# EasyEDA Pro project AD8302_嘉立创.eprj

# Schematic Schematic1
Create Date: 2023-10-31; Page Name: P1; Project Name: AD8302_copy; Schematic Name: Schematic1; Update Date: 2023-11-06; Company: 嘉立创EDA; Page Size: A4; Version: V1.0
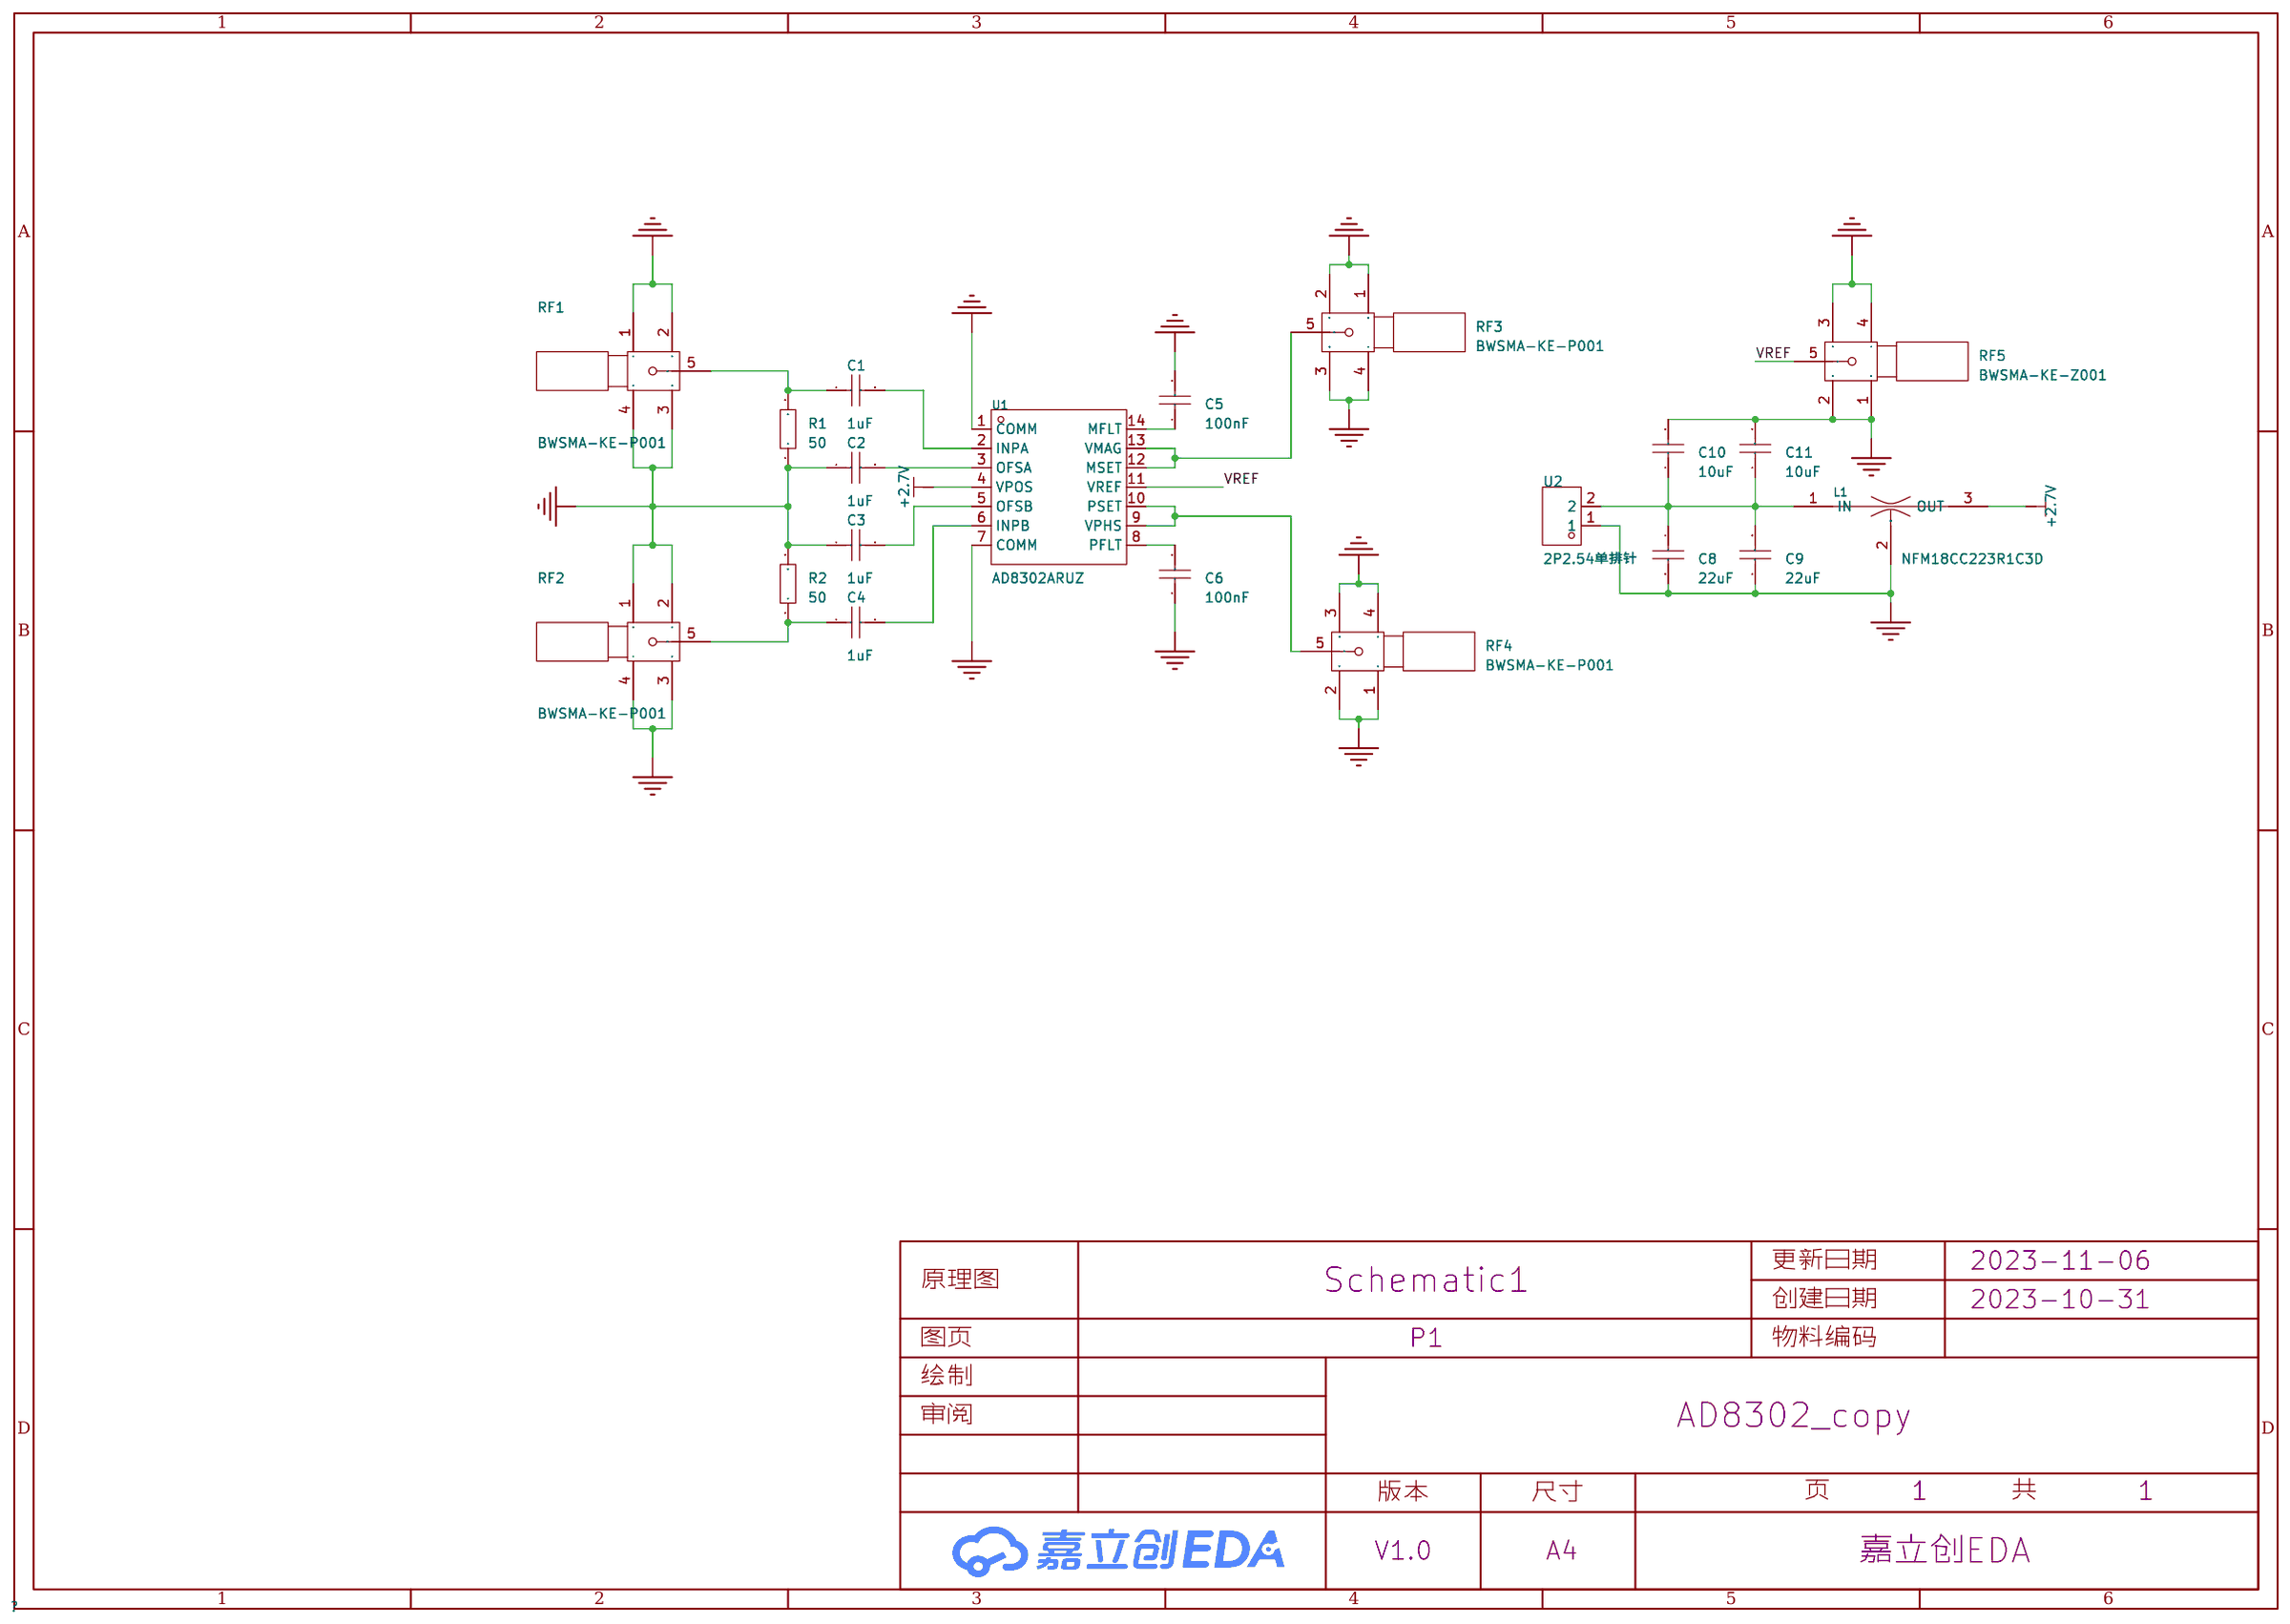
[diagram p0: schematic sheet]

## Parts
C1  1uF  [C0603]
C2  1uF  [C0603]
C3  1uF  [C0603]
C4  1uF  [C0603]
C5  100nF  [C0603]
C6  100nF  [C0603]
C8  22uF  [C0805]
C9  22uF  [C0805]
C10  10uF  [C0603]
C11  10uF  [C0603]
L1  NFM18CC223R1C3D  [FILTER-SMD_3P-L1.6-W0.8-L_NFM18CC223R1C3D]
R1  50  [R0603]
R2  50  [R0603]
RF1  BWSMA-KE-P001  [SMA-SMD_BWSMA-KE-P001]
RF2  BWSMA-KE-P001  [SMA-SMD_BWSMA-KE-P001]
RF3  BWSMA-KE-P001  [SMA-SMD_BWSMA-KE-P001]
RF4  BWSMA-KE-P001  [SMA-SMD_BWSMA-KE-P001]
RF5  BWSMA-KE-Z001  [SMA-TH_BWSMA-KE-Z001]
U1  AD8302ARUZ  [TSSOP-14_L5.0-W4.4-P0.65-LS6.4-BL]
U2  2P2.54单排针  [HDR-TH_2P-P2.54-V-M]

## Library data of the parts
C1-C6 C8-C11 = CL10A105KB8NNNC: 容值:1uF;精度:±10%;额定电压:50V;材质(温度系数):X5R;; LCSC Part Name: 1uF ±10% 50V; Supplier Part: C45783; Manufacturer: SAMSUNG(三星); Supplier Footprint: 0603; JLCPCB Part Class: 基础库; Datasheet: https://atta.szlcsc.com/upload/public/pdf/source/20160103/1457707679084.pdf; Supplier: LCSC; Tolerance: ±10%; Voltage Rated: 50V; Temperature Coefficient: X5R
L1 = NFM18CC223R1C3D: 电容量:22nF;精度:±20%;直流电阻:50mΩ;; LCSC Part Name: 22nF(223) ±20% 16V; Supplier Part: C98102; Manufacturer: muRata(村田); Supplier Footprint: SMD-3P,0.8x1.6mm; JLCPCB Part Class: 扩展库; Datasheet: https://atta.szlcsc.com/upload/public/pdf/source/20170310/1489116427722.pdf; Supplier: LCSC; Nominal Capacitance: 22nF; CapacitanceTolerance: ±20%; DC Rated Voltage: 16V; Rated Current: 1A; DC Resistance: 50mΩ; Operating Temperature: -55℃~+125℃
R1 R2 = Res_0603: Supplier Footprint: 0603; Supplier Part: C2759402
RF1-RF4 = BWSMA-KE-P001: 连接器类型:板端;射频系列:SMA;接口类型:内孔;端口数量:1;阻抗:50Ω;频率-最大值:12.4GHz;样式:偏脚;接口直径:5.2mm;接口长度/高度:-;工作温度范围:-;; LCSC Part Name: SMA 内孔 偏脚 SMA偏脚板端座子; Supplier Part: C496550; Manufacturer: BAT WIRELESS(蝙蝠无线); Supplier Footprint: 插件; JLCPCB Part Class: 扩展库; Datasheet: https://atta.szlcsc.com/upload/public/pdf/source/20200416/C496550_06668BF2E3B968EA39F96D17E7156373.pdf; Supplier: LCSC; Connector Type: 板端; RF Series: SMA; Interface Type: 内孔; Number of Ports: 1; Impedance: 50Ω; Frequency-Max: 12.4GHz; Style: 偏脚; Interface Diameter: 5.2mm
RF5 = BWSMA-KE-Z001_C496549: 连接器类型:板端;射频系列:SMA;接口类型:内孔;端口数量:1;阻抗:50Ω;频率-最大值:12.4GHz;样式:正脚;接口直径:-;接口长度/高度:-;工作温度范围:-65℃~+165℃;; LCSC Part Name: SMA 内孔 正脚 SMA直头正脚板端座子; Supplier Part: C496549; Manufacturer: BAT WIRELESS(蝙蝠无线); Supplier Footprint: 插件; JLCPCB Part Class: 扩展库; Datasheet: https://atta.szlcsc.com/upload/public/pdf/source/20200416/C496549_767995352B6C9E98F20D658FDC70347F.pdf; Supplier: LCSC; Connector Type: 板端; RF Series: SMA; Interface Type: 内孔; Number of Ports: 1; Impedance: 50Ω; Frequency-Max: 12.4GHz; Style: 正脚; Operating Temperature Range: -65℃~+165℃
U1 = AD8302ARUZ: 应用领域:通用;频率范围:2.7GHz;输入范围:-60dBm~0dBm;精度:±0.5dB;; Supplier Part: C578682; Manufacturer: ADI(亚德诺); Supplier Footprint: TSSOP-14; JLCPCB Part Class: Extended Part; Datasheet: https://atta.szlcsc.com/upload/public/pdf/source/20190807/C408900_5BB3D180A454BA6F4D99553AB0F529A5.pdf; Supplier: LCSC; Applications: 通用; Frequency Range: 2.7GHz; Supply Voltage: 2.7V~5.5V; Supply Current: 23mA; Input Range: -60dBm~0dBm; Accuracy: ±0.5dB
U2 = 2P2.54单排针: Supplier Part: C9900015265; Supplier Footprint: HDR1X2; JLCPCB Part Class: 扩展库; Datasheet: https://atta.szlcsc.comnull; Supplier: LCSC

## Nets
+2.7V: L1.3(OUT) U1.4(VPOS)
GND: C2.1 C3.1 C5.2 C6.2 C8.2 C9.1 C10.2 C11.2 L1.2(GND) R1.1 R2.2 RF1.1 RF1.2 RF1.3 RF1.4 RF2.1 RF2.2 RF2.3 RF2.4 RF3.1 RF3.2 RF3.3 RF3.4 RF4.1 RF4.2 RF4.3 RF4.4 RF5.1 RF5.2 RF5.3 RF5.4 U1.1(COMM) U1.7(COMM) U2.1
VREF: RF5.5 U1.11(VREF)
$1N2986: C2.2 U1.3(OFSA)
$1N2989: C1.2 U1.2(INPA)
$1N3092: C3.2 U1.5(OFSB)
$1N3097: C4.2 U1.6(INPB)
$1N3135: C4.1 R2.1 RF2.5
$1N3140: C1.1 R1.2 RF1.5
$1N3454: C6.1 U1.8(PFLT)
$1N3571: C5.1 U1.14(MFLT)
$1N3581: RF3.5 U1.12(MSET) U1.13(VMAG)
$1N3599: RF4.5 U1.9(VPHS) U1.10(PSET)
$1N3862: C8.1 C9.2 C10.1 C11.1 L1.1(IN) U2.2

# Board PCB1
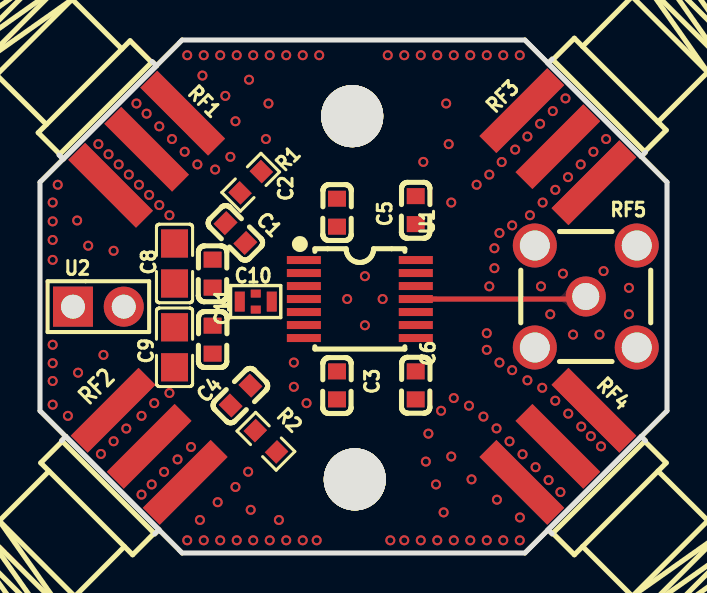
[diagram p1: board, top side]
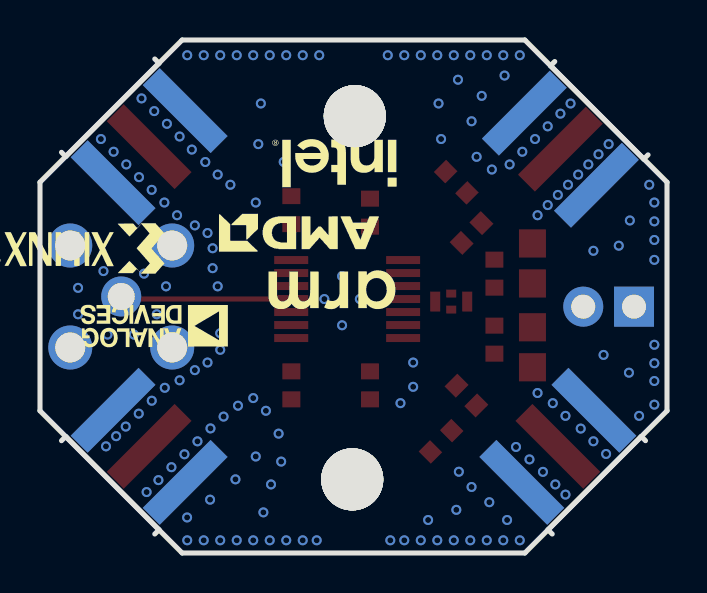
[diagram p2: board, bottom side, seen from below]

Outline 31.37 x 25.65 mm; copper layers: Top Layer, Bottom Layer. Coordinates in mm from the lower left corner of the outline.
Outline path: 0,18.54 0,7.11 7.11,0 24.26,0 31.37,7.11 31.37,18.54 24.26,25.65 7.11,25.65 0,18.54
Stack: Top Layer 0.035mm / Dielectric1 1.51mm FR4 er 4.5 / Bottom Layer 0.035mm

## Design rules (mm)
template: 自定义配置
spacing copperThickness1oz (default): track to track 0.102, other pairs 0.152 to 0.3
spacing copperThickness2oz: track to track 0.203, other pairs 0.152 to 0.3
track width copperThickness1oz (default): min 0.127, default 0.254, max 2.54
track width copperThickness2oz: min 0.203, default 0.254, max 2.54
differential pair differentialPair (default): width min 0.127, default 0.254, max 2.54; gap min 0.152, default 0.152
via viaSize (default): diameter min 0.5, default 0.61, max 10; hole min 0.3, default 0.305, max 6.3

## Placement (name value [footprint] x y rotation side)
C1  1uF  [C0603]  9.78 16 315 top
C2  1uF  [C0603]  14.86 17.02 270 top
C3  1uF  [C0603]  14.86 8.38 90 top
C4  1uF  [C0603]  10.03 7.87 45 top
C5  100nF  [C0603]  18.8 17.14 90 top
C6  100nF  [C0603]  18.8 8.38 270 top
C8  22uF  [C0805]  6.73 14.48 90 top
C9  22uF  [C0805]  6.73 10.29 90 top
C10  10uF  [C0603]  8.64 13.97 90 top
C11  10uF  [C0603]  8.64 10.67 270 top
L1  NFM18CC223R1C3D  [FILTER-SMD_3P-L1.6-W0.8-L_NFM18CC223R1C3D]  10.79 12.57 0 top
NOREF  -  [Pad_e194]  15.62 21.84 0 top
NOREF#2  -  [Pad_e113]  15.62 21.84 0 top
NOREF#3  -  [Pad_e112]  15.75 3.68 0 top
NOREF#4  -  [Pad_e86]  15.62 21.84 0 top
NOREF#5  -  [Pad_e85]  15.75 3.68 0 top
NOREF#6  -  [Pad_e143]  15.75 3.68 0 top
R1  50  [R0603]  10.54 18.54 225 top
R2  50  [R0603]  11.3 5.59 315 top
RF1  BWSMA-KE-P001  [SMA-SMD_BWSMA-KE-P001]  5.33 20.19 135 top
RF2  BWSMA-KE-P001  [SMA-SMD_BWSMA-KE-P001]  5.46 5.33 225 top
RF3  BWSMA-KE-P001  [SMA-SMD_BWSMA-KE-P001]  25.91 20.32 45 top
RF4  BWSMA-KE-P001  [SMA-SMD_BWSMA-KE-P001]  25.91 5.33 315 top
RF5  BWSMA-KE-Z001  [SMA-TH_BWSMA-KE-Z001]  27.31 12.83 0 top
U1  AD8302ARUZ  [TSSOP-14_L5.0-W4.4-P0.65-LS6.4-BL]  16 12.7 270 top
U2  2P2.54单排针  [HDR-TH_2P-P2.54-V-M]  2.92 12.32 0 top

## Footprints (pads in the part's own frame, mm; a bottom-side part is the same pattern mirrored in y, then rotated)
C0603
  rect 0.8x0.9 smd: 1(-0.7,0) 2(0.7,0)
C0805
  rect 1.41x1.35 smd: 1(-1,0) 2(1,0)
FILTER-SMD_3P-L1.6-W0.8-L_NFM18CC223R1C3D
  rect 0.5x1 smd: 1(-0.8,0) 3(0.8,0)
  rect 0.5x0.4 smd: 2(0,0.4) 2(0,-0.4)
HDR-TH_2P-P2.54-V-M
  rect 2x2 hole 1.2: 1(-1.27,0)
  round 2 hole 1.2: 2(1.27,0)
Pad_e85
  round 3.099 hole 3.099: 15(0,0)
Pad_e86
  round 3.099 hole 3.099: 15(0,0)
Pad_e112
  round 3.099 hole 3.099: 15(0,0)
Pad_e113
  round 3.099 hole 3.099: 15(0,0)
Pad_e143
  round 3.099 hole 3.099: 15(0,0)
Pad_e194
  round 3.099 hole 3.099: 15(0,0)
R0603
  rect 0.806x0.864 smd: 1(-0.753,0) 2(0.753,0)
SMA-SMD_BWSMA-KE-P001
  rect 4.8x1.2 smd: 1(0,-2.55) 2(0,2.55) 5(0,0)
  rect 4.8x1.2 smd far side: 3(0,2.55) 4(0,-2.55)
SMA-TH_BWSMA-KE-Z001
  round 2.2 hole 1.5: 1(-2.55,-2.55) 2(-2.55,2.55) 3(2.55,2.55) 4(2.55,-2.55)
  round 2 hole 1.35: 5(0,0)
TSSOP-14_L5.0-W4.4-P0.65-LS6.4-BL
  rect 0.4x1.7 smd: 1(-1.95,-2.8) 2(-1.3,-2.8) 3(-0.65,-2.8) 4(0,-2.8) 5(0.65,-2.8) 6(1.3,-2.8) 7(1.95,-2.8) 8(1.95,2.8) 9(1.3,2.8) 10(0.65,2.8) 11(0,2.8) 12(-0.65,2.8) 13(-1.3,2.8) 14(-1.95,2.8)

## Nets
As in the schematic.

Pads without a net: NOREF 15; NOREF#2 15; NOREF#3 15; NOREF#4 15; NOREF#5 15; NOREF#6 15

## Via types
v1: diameter 0.5, hole 0.3, Top Layer to Bottom Layer, 158 vias

## Routing (per net, layer and track width the routed paths; a pad name or vN(x,y) marks a point on that pad's centre or on a via; arc(x,y) is an arc through that point)
GND:
  vias: v1(0.63,17.53) v1(0.63,16.58) v1(0.63,15.65) v1(0.63,14.66) v1(0.63,10.41) v1(0.63,9.49) v1(0.63,8.6) v1(0.63,7.42) v1(0.89,18.42) v1(1.4,6.86) v1(1.86,16.63) v1(1.91,9.02) v1(2.41,15.37) v1(2.92,20.45) v1(3.05,4.95) v1(3.18,9.91) v1(3.43,19.94) v1(3.68,15.11) v1(3.68,5.59) v1(3.94,19.43) v1(4.32,6.22) v1(4.44,18.92) v1(4.83,22.48) v1(4.95,18.42) v1(5.08,6.86) v1(5.08,2.92) v1(5.33,21.97) v1(5.46,17.91) v1(5.59,3.43) v1(5.72,7.49) v1(5.97,21.34) v1(5.97,17.4) v1(6.21,4.06) v1(6.48,16.89) v1(6.48,8) v1(6.6,20.7) v1(6.88,4.68) v1(7.24,20.07) v1(7.37,24.89) v1(7.37,0.64) v1(7.56,5.3) v1(7.87,19.43) v1(8,1.65) v1(8.13,23.88) v1(8.19,24.89) v1(8.19,0.64) v1(8.76,19.18) v1(8.89,2.54) v1(9.02,24.89) v1(9.02,0.64) v1(9.27,22.86) v1(9.53,19.81) v1(9.84,24.89) v1(9.78,21.59) v1(9.78,3.3) v1(9.84,0.64) v1(10.41,4.06) v1(10.46,23.67) v1(10.54,2.16) v1(10.67,24.89) v1(10.67,0.64) v1(11.3,20.7) v1(11.43,22.48) v1(11.49,24.89) v1(11.49,0.64) v1(11.95,1.65) v1(12.32,24.89) v1(12.32,0.64) v1(12.7,9.53) v1(12.7,8.31) v1(13.14,24.89) v1(13.14,0.64) v1(13.34,7.49) v1(13.84,0.64) v1(13.97,24.89) v1(15.37,12.7) v1(16.26,13.84) v1(16.26,11.39) v1(17.14,12.7) v1(17.4,24.89) v1(17.53,0.64) v1(18.22,24.89) v1(18.22,0.64) v1(19.05,24.89) v1(19.05,0.64) v1(19.18,19.56) v1(19.3,4.57) v1(19.43,5.97) v1(19.81,3.43) v1(19.88,24.89) v1(19.88,0.64) v1(20.07,7.11) v1(20.19,2.03) v1(20.32,22.48) v1(20.45,20.45) v1(20.57,17.53) v1(20.57,4.83) v1(20.7,24.89) v1(20.7,7.75) v1(20.7,0.64) v1(21.53,24.89) v1(21.46,7.37) v1(21.53,0.64) v1(21.59,3.68) v1(21.84,18.42) v1(22.18,6.82) v1(22.35,24.89) v1(22.35,10.99) v1(22.35,10.16) v1(22.35,0.64) v1(22.48,18.92) v1(22.48,13.33) v1(22.73,15.24) v1(22.73,14.24) v1(22.84,6.23) v1(22.86,2.67) v1(22.99,16) v1(22.99,9.53) v1(23.1,19.55) v1(23.18,24.89) v1(23.18,0.64) v1(23.49,5.58) v1(23.62,16.38) v1(23.62,9.14) v1(23.77,20.17) v1(24,24.89) v1(24.01,1.78) v1(24,0.64) v1(24.14,4.94) v1(24.38,20.83) v1(24.38,8.64) v1(24.51,16.89) v1(24.79,4.29) v1(25.02,21.46) v1(25.15,17.53) v1(25.06,13.33) v1(25.13,8.26) v1(25.44,3.64) v1(25.53,11.94) v1(25.65,22.1) v1(25.78,18.16) v1(25.78,7.62) v1(26.03,3.05) v1(26.16,13.97) v1(26.29,22.73) v1(26.42,18.8) v1(26.43,6.97) v1(26.67,10.92) v1(27.05,19.43) v1(27.08,6.32) v1(27.56,5.84) v1(27.69,20.07) v1(27.99,10.92) v1(28.07,5.33) v1(28.19,14.1) v1(28.32,20.7) v1(29.46,13.26) v1(29.46,11.94)
VREF: length 8.6
  Top Layer w0.254: RF5.5 27.18,12.7 U1.11

## Copper pours and planes (outline as drawn; the poured copper is in the pictures)
+2.7V on Top Layer: 12.22,13.08 12.34,12.96 13.34,12.96 13.34,12.45 12.45,12.45 11.94,11.94 11.3,11.94 11.3,13.08
GND on Top Layer: -3.66,27.22 33.91,27.22 33.91,-1.51 -3.66,-1.51
GND on Bottom Layer: -4.95,27.43 36.19,27.43 36.19,-2.67 -4.95,-2.67
$1N2986 on Top Layer: 12.83,13.59 14.1,13.59 14.35,13.84 14.35,16.74 15.57,16.74 15.57,13.54 15.12,13.09 12.83,13.09
$1N2989 on Top Layer: 9.78,15.5 9.78,15.12 11.05,13.84 13.59,13.84 13.59,14.3 11.86,14.3 11.81,14.35 11.81,14.52 10.33,16.01 9.82,15.5
$1N3092 on Top Layer: 14.99,12.32 15.24,12.06 15.24,8.58 14.79,8.58 14.48,8.89 14.48,11.65 14.32,11.81 12.81,11.81 12.81,11.82 12.7,11.94 12.7,12.32
$1N3097 on Top Layer: 12.17,11.81 10.15,9.8 10.15,8.12 10.89,8.12 11.3,8.54 11.3,9.72 11.94,10.36 11.94,10.41 12.31,11.19 14.18,11.19 14.18,11.81
$1N3135 on Top Layer: 3.18,4.32 7.43,8.1 9.23,8.73 11.7,6.26 10.65,5.21 10.54,5.21 9.14,6.6 8.04,6.6 4.33,3.16
$1N3140 on Top Layer: 3.18,21.46 9.02,15.62 9.27,15.62 11.25,17.6 9.71,19.14 9.11,18.72 7.92,18.72 4.18,22.47
$1N3454 on Top Layer: 19.24,10.92 19.24,9.21 19.3,9.14 18.8,8.64 18.28,8.64 18.28,10.92
$1N3571 on Top Layer: 19.5,16.68 19.5,14.66 19.69,14.48 17.99,14.48 17.99,16.56 17.91,16.64 17.95,16.68
$1N3581 on Top Layer: 17.91,14.22 19.81,14.22 19.81,15.33 20.1,15.74 26.99,22.67 28.18,21.49 23.42,16.7 22.03,16.7 21.59,16.17 21.59,14 21.18,13.1 17.91,13.1
$1N3599 on Top Layer: 18.29,12.32 20.32,12.32 21.46,11.18 21.46,10.41 23.37,8.51 28.04,4.33 26.83,3.11 20.07,9.78 20.07,11.05 18.29,11.05
$1N3862 on Top Layer: 3.12,10.72 3.17,10.68 9.46,10.68 10.34,11.56 10.41,11.56 10.41,13.37 10.03,13.75 10.03,13.97 3.12,13.96

Small or netless copper shapes (teardrops, artwork), in the pictures only: 2 on Top Layer

## Text on the board
Top Silkscreen Layer: RF2
